# EAGLE schematic USB_midi_controller (EAGLE 7.6.0)
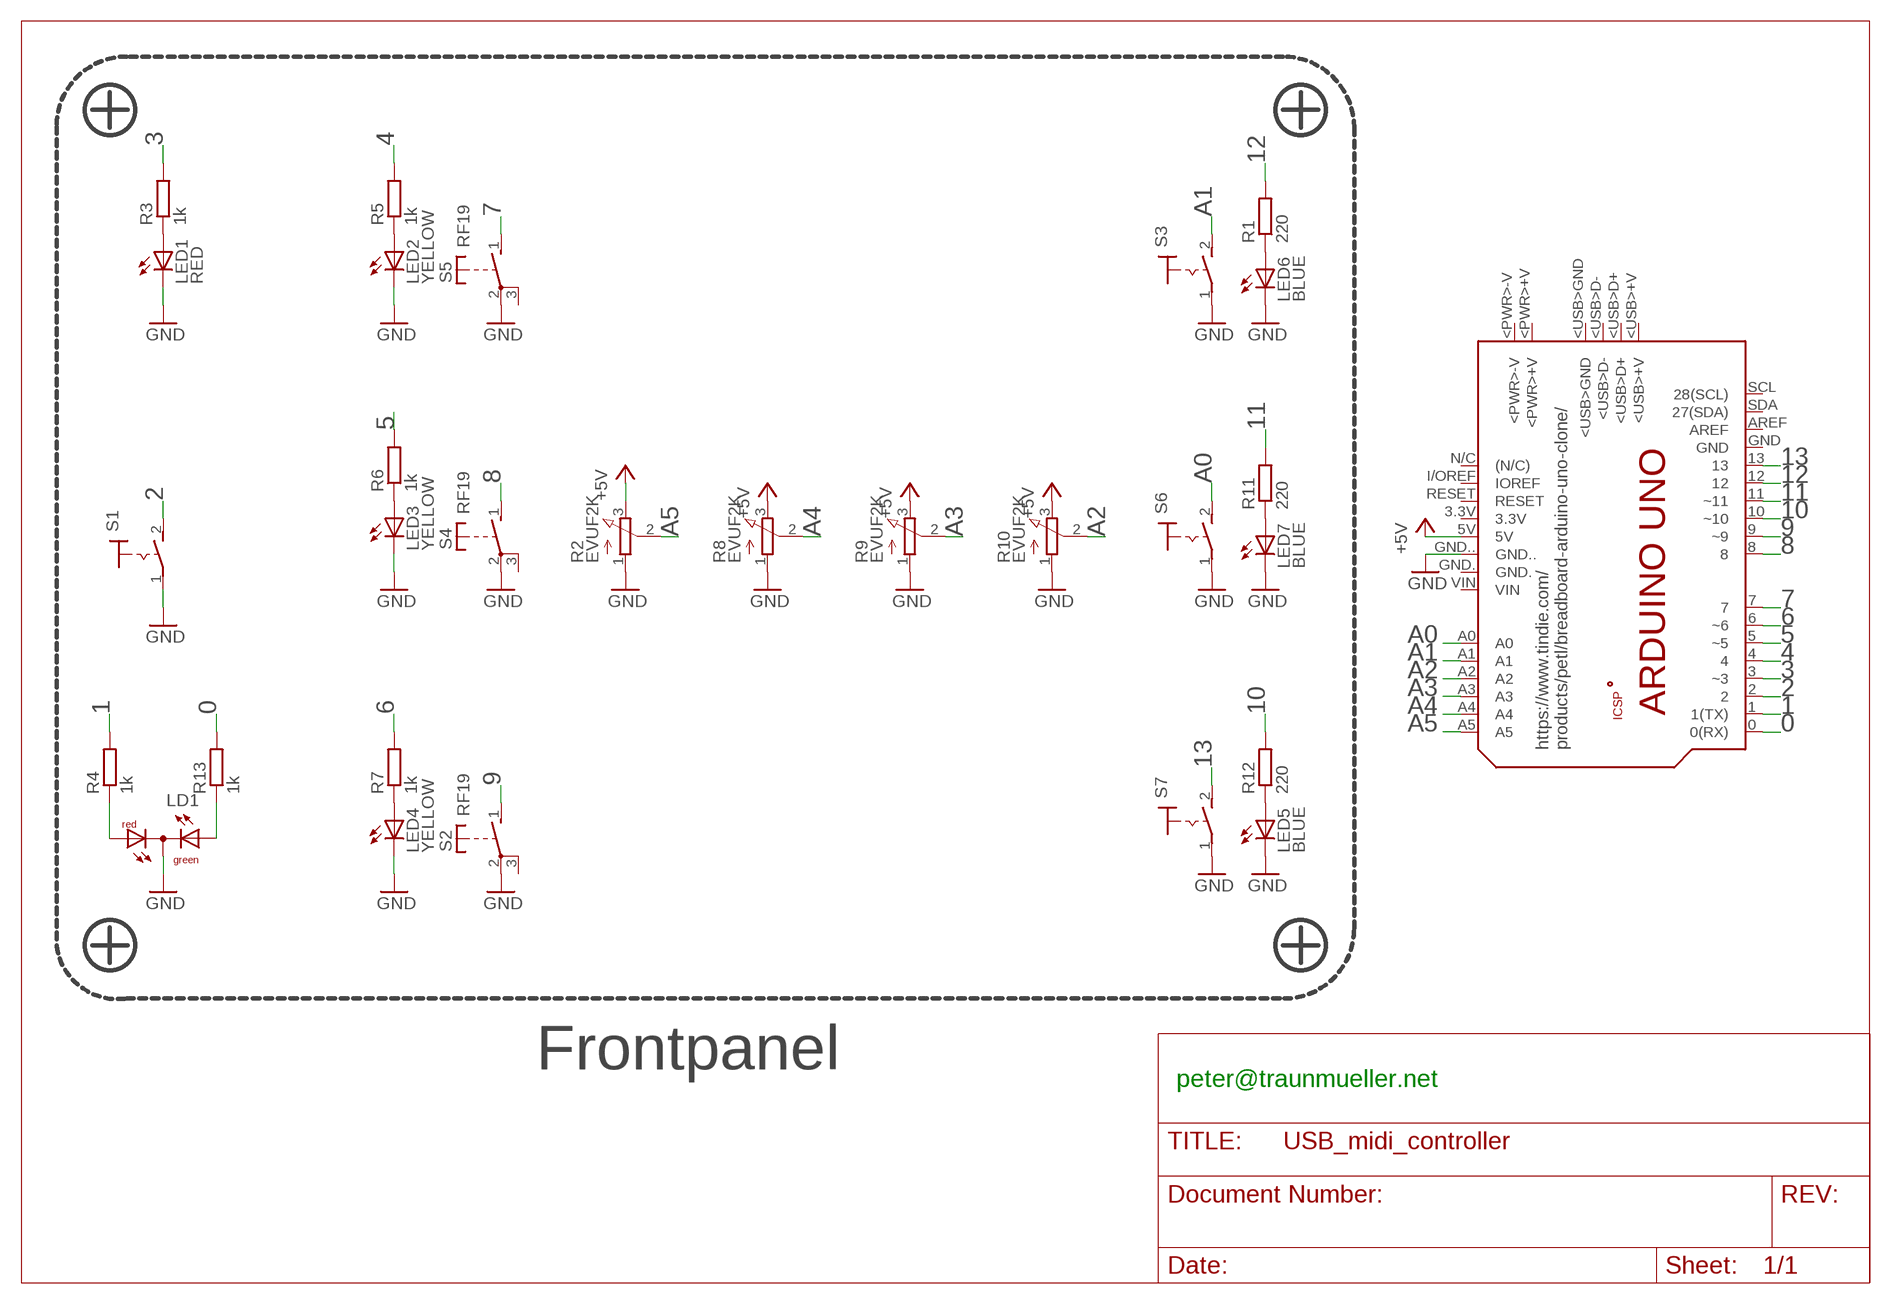
[diagram p0: schematic, sheet 1]

## Parts
LD1  DUOLED-RG-C  [DUOLED-C-5MM]
LED1  RED  LED5MM  [LED5MM]
LED2  YELLOW  LED5MM  [LED5MM]
LED3  YELLOW  LED5MM  [LED5MM]
LED4  YELLOW  LED5MM  [LED5MM]
LED5  BLUE  LED5MM  [LED5MM]
LED6  BLUE  LED5MM  [LED5MM]
LED7  BLUE  LED5MM  [LED5MM]
PCB1  ARDUINO_UNO  [ARDUINO_UNO]
R1  220  R-EU_R0805  [R0805]
R2  EVUF2K  [EVUFXK]
R3  1k  R-EU_R0805  [R0805]
R4  1k  R-EU_R0805  [R0805]
R5  1k  R-EU_R0805  [R0805]
R6  1k  R-EU_R0805  [R0805]
R7  1k  R-EU_R0805  [R0805]
R8  EVUF2K  [EVUFXK]
R9  EVUF2K  [EVUFXK]
R10  EVUF2K  [EVUFXK]
R11  220  R-EU_R0805  [R0805]
R12  220  R-EU_R0805  [R0805]
R13  1k  R-EU_R0805  [R0805]
S1  KSR224G  [KSR224G]
S2  RF19  [RF19]
S3  KSR224G  [KSR224G]
S4  RF19  [RF19]
S5  RF19  [RF19]
S6  KSR224G  [KSR224G]
S7  KSR224G  [KSR224G]

## Nets
0: PCB1.0(0(RX)) R13.2
1: PCB1.1(1(TX)) R4.2
2: PCB1.2 S1.2(S)
3: PCB1.3(~3) R3.2
4: PCB1.4 R5.2
5: PCB1.5(~5) R6.2
6: PCB1.6(~6) R7.2
7: PCB1.7 S5.1(S)
8: PCB1.8 S4.1(S)
9: PCB1.9(~9) S2.1(S)
10: PCB1.10(~10) R12.2
11: PCB1.11(~11) R11.2
12: PCB1.12 R1.2
13: PCB1.13 S7.2(S)
+5V: PCB1.5V R2.3(E) R8.3(E) R9.3(E) R10.3(E)
A0: PCB1.A0 S6.2(S)
A1: PCB1.A1 S3.2(S)
A2: PCB1.A2 R10.2(S)
A3: PCB1.A3 R9.2(S)
A4: PCB1.A4 R8.2(S)
A5: PCB1.A5 R2.2(S)
GND: LD1.C LED1.K(C) LED2.K(C) LED3.K(C) LED4.K(C) LED5.K(C) LED6.K(C) LED7.K(C) PCB1.GND.. R2.1(A) R8.1(A) R9.1(A) R10.1(A) S1.1(P) S2.2(P) S3.1(P) S4.2(P) S5.2(P) S6.1(P) S7.1(P)
N$1: LED1.A R3.1
N$2: LED2.A R5.1
N$3: LED3.A R6.1
N$4: LED4.A R7.1
N$5: LED6.A R1.1
N$6: LED7.A R11.1
N$7: LED5.A R12.1
N$24: LD1.AR R4.1
N$25: LD1.AX(AG) R13.1
Unconnected: PCB1.3.3V PCB1.+5V PCB1.<PWR>+V PCB1.<PWR>-V PCB1.<USB>+V PCB1.<USB>D+ PCB1.<USB>D- PCB1.<USB>GND PCB1.AREF PCB1.GND PCB1.GND. PCB1.GND_ PCB1.I/OREF(IOREF) PCB1.MISO PCB1.MOSI PCB1.N/C((N/C)) PCB1.RESET PCB1.RESET. PCB1.SCK PCB1.SCL(28(SCL)) PCB1.SDA(27(SDA)) PCB1.VIN S2.3(P) S4.3(P) S5.3(P)

## Notes on the sheet
- https://www.tindie.com/
  products/petl/breadboard-arduino-uno-clone/
- Frontpanel
- peter@traunmueller.net

## Library data of the parts
LD1 = led:DUOLED-RG-C: DUO LED 2 colors (red/green), 5 mm, round, common Cathode www.ligitek.com or other producers.
LED1-LED7 = led:LED: LED OSRAM: - CHIPLED LG R971, LG N971, LY N971, LG Q971, LY Q971, LO R971, LY R971 LH N974, LH R974 LS Q976, LO Q976, LY Q976 LO Q996 - Hyper CHIPLED LW Q18S LB Q993, LB Q99A, LB R99A - SideLED LS A670, LO A670, LY A670, LG A670, LP A670 LB A673, LV A673, LT A673, LW A673 LH A674 LY A675 LS A676, LA A676, LO A676, LY A676, LW A676 LS A679, LY A679, LG A679 - Hyper Micro SIDELED® LS Y876, LA Y876, LO Y876, LY Y876 LT Y87S - SmartLED LW L88C, LW L88S LB L89C, LB L89S, LG L890 LS L89K, LO L89K, LY L89K LS L896, LA L896, LO L896, LY L896 - TOPLED LS T670, LO T670, LY T670, LG T670, LP T670 LSG T670, LSP T670, LSY T670, LOP T670, LYG T670 LG T671, LOG T671, LSG T671 LB T673, LV T673, LT T673, LW T673 LH T674 LS T676, LA T676, LO T676, LY T676, LB T676, LH T676, LSB T676, LW T676 LB T67C, LV T67C, LT T67C, LS T67K, LO T67K, LY T67K, LW E67C LS E67B, LA E67B, LO E67B, LY E67B, LB E67C, LV E67C, LT E67C LW T67C LS T679, LY T679, LG T679 LS T770, LO T770, LY T770, LG T770, LP T770 LB T773, LV T773, LT T773, LW T773 LH T774 LS E675, LA E675, LY E675, LS T675 LS T776, LA T776, LO T776, LY T776, LB T776 LHGB T686 LT T68C, LB T68C - Hyper Mini TOPLED® LB M676 - Mini TOPLED Santana® LG M470 LS M47K, LO M47K, LY M47K Source: http://www.osram.convergy.de LUXEON: - LUMILED® LXK2-PW12-R00, LXK2-PW12-S00, LXK2-PW14-U00, LXK2-PW14-V00 LXK2-PM12-R00, LXK2-PM12-S00, LXK2-PM14-U00 LXK2-PE12-Q00, LXK2-PE12-R00, LXK2-PE12-S00, LXK2-PE14-T00, LXK2-PE14-U00 LXK2-PB12-K00, LXK2-PB12-L00, LXK2-PB12-M00, LXK2-PB14-N00, LXK2-PB14-P00, LXK2-PB14-Q00 LXK2-PR12-L00, LXK2-PR12-M00, LXK2-PR14-Q00, LXK2-PR14-R00 LXK2-PD12-Q00, LXK2-PD12-R00, LXK2-PD12-S00 LXK2-PH12-R00, LXK2-PH12-S00 LXK2-PL12-P00, LXK2-PL12-Q00, LXK2-PL12-R00 Source: www.luxeon.com KINGBRIGHT: KA-3528ASYC Source: www.kingbright.com
PCB1 = E14_Arduino_revB:ARDUINO_UNO: Device for representing an Arduino Uno board with a footprint in an EAGLE design. Created by Dave Young for Element14. More EAGLE documentation at: http://www.element14.com/community/community/knode/cadsoft_eagle
R1 R3-R7 R11-R13 = rcl:R-EU_: RESISTOR, European symbol
R2 R8-R10 = pot:EVU: 9 mm Square Rotary Potentiometers Source: Panasonic
S1 S3 S6 S7 = switch:KSR224G: TOGGLE SWITCH
S2 S4 S5 = switch-misc:RF19: RAFI SWITCH